# EAGLE design nolleblink2013 (EAGLE 6.4)
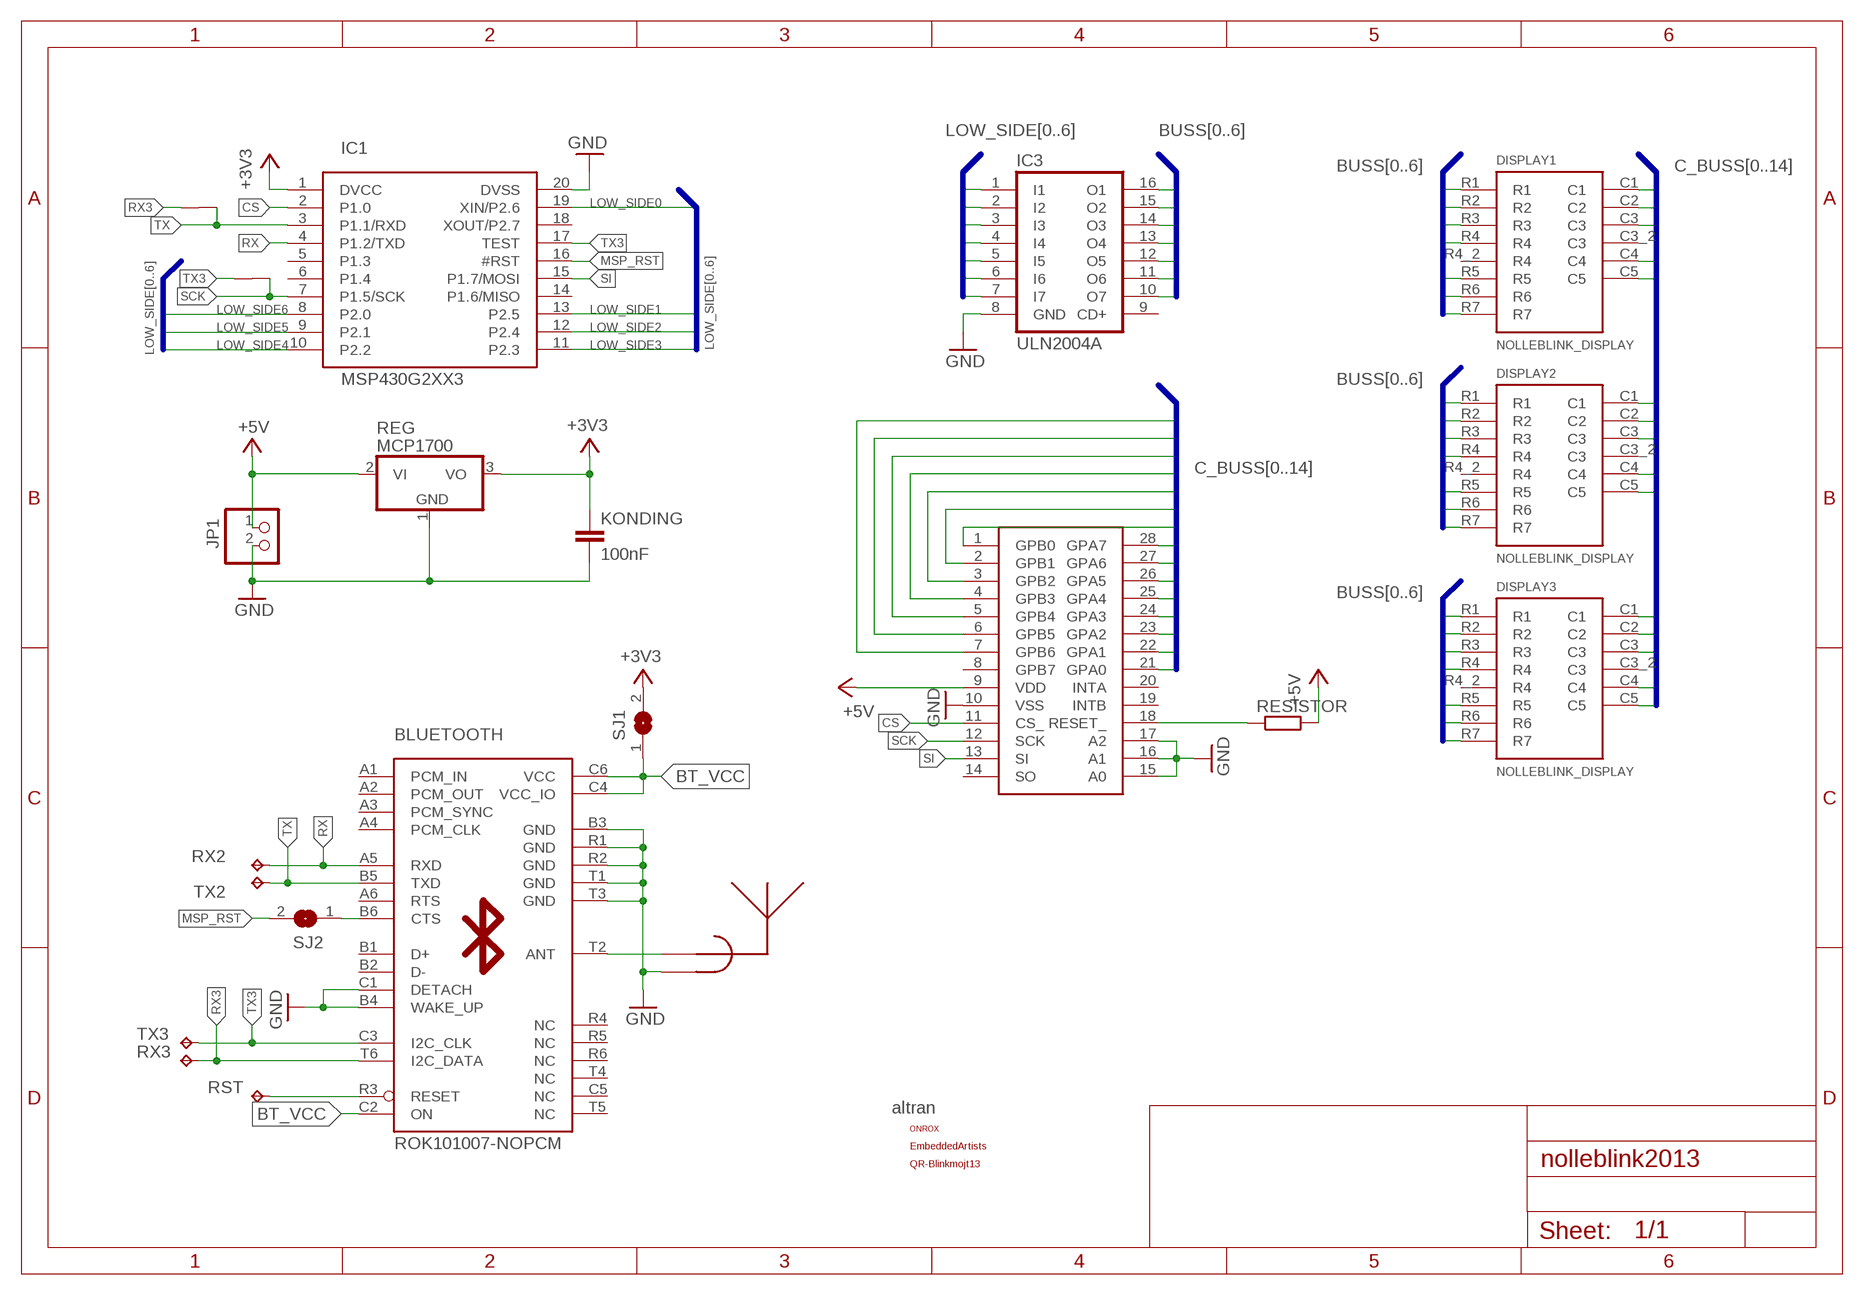
[diagram p0: schematic, sheet 1]

## Parts
BLUETOOTH  ROK101007-NOPCM  [ROK101007_NOPCM]
DISPLAY1  NOLLEBLINK_DISPLAY  [KINGBRIGHT_TA12-11EWA]
DISPLAY2  NOLLEBLINK_DISPLAY  [KINGBRIGHT_TA12-11EWA]
DISPLAY3  NOLLEBLINK_DISPLAY  [KINGBRIGHT_TA12-11EWA]
IC1  MSP430G2XX3  [N20]
IC2  MCPS23S17  [MCP23S17]
IC3  ULN2004A  ULN2004AN  [DIL16]
JP1  PINHD-1X2  [1X02]
KONDING  100nF  C-EU050-030X075  [C050-030X075]
REG  MCP1700  MCP_REGULATOR  [TO92_REGULATOR]
RESISTOR  R-EU_0207/10  [0207/10]
RST  TPTP12SQ  [TP12SQ]
RX2  TPTP20SQ  [TP20SQ]
RX3  TPTP12SQ  [TP12SQ]
SJ1  SJ  [SJ]
SJ2  SJ  [SJ]
TX2  TPTP20SQ  [TP20SQ]
TX3  TPTP12SQ  [TP12SQ]
U$1  ALTRAN  [ALTRAN]
U$2  ONROX  [ONROX]
U$3  INV_F_24  [INV_F_ANTENNA]
U$4  EMBEDDEDARTISTS  [EMBEDDEDARTISTS]
U$5  JUNCTION  [JUNCTION]
U$6  JUNCTION  [JUNCTION]
U$7  BLINKMOJT13  [BLINKMOJT13]

## Nets
+3V3: IC1.1(DVCC) KONDING.1 REG.3(VO) SJ1.2
+5V: IC2.9(VDD) JP1.1 REG.2(VI) RESISTOR.2
BT_VCC: BLUETOOTH.C2(ON) BLUETOOTH.C4(VCC_IO) BLUETOOTH.C6(VCC) SJ1.1
BUSS0: DISPLAY1.R1 DISPLAY2.R1 DISPLAY3.R1 IC3.16(O1)
BUSS1: DISPLAY1.R2 DISPLAY2.R2 DISPLAY3.R2 IC3.15(O2)
BUSS2: DISPLAY1.R3 DISPLAY2.R3 DISPLAY3.R3 IC3.14(O3)
BUSS3: DISPLAY1.R4 DISPLAY2.R4 DISPLAY3.R4 IC3.13(O4)
BUSS4: DISPLAY1.R5 DISPLAY2.R5 DISPLAY3.R5 IC3.12(O5)
BUSS5: DISPLAY1.R6 DISPLAY2.R6 DISPLAY3.R6 IC3.11(O6)
BUSS6: DISPLAY1.R7 DISPLAY2.R7 DISPLAY3.R7 IC3.10(O7)
C_BUSS0: DISPLAY1.C1 IC2.21(GPA0)
C_BUSS1: DISPLAY1.C2 IC2.22(GPA1)
C_BUSS2: DISPLAY1.C3 IC2.23(GPA2)
C_BUSS3: DISPLAY1.C4 IC2.24(GPA3)
C_BUSS4: DISPLAY1.C5 IC2.25(GPA4)
C_BUSS5: DISPLAY2.C1 IC2.26(GPA5)
C_BUSS6: DISPLAY2.C2 IC2.27(GPA6)
C_BUSS7: DISPLAY2.C3 IC2.28(GPA7)
C_BUSS8: DISPLAY2.C4 IC2.1(GPB0)
C_BUSS9: DISPLAY2.C5 IC2.2(GPB1)
C_BUSS10: DISPLAY3.C1 IC2.3(GPB2)
C_BUSS11: DISPLAY3.C2 IC2.4(GPB3)
C_BUSS12: DISPLAY3.C3 IC2.5(GPB4)
C_BUSS13: DISPLAY3.C4 IC2.6(GPB5)
C_BUSS14: DISPLAY3.C5 IC2.7(GPB6)
CS: IC1.2(P1.0) IC2.11(CS_)
GND: BLUETOOTH.B3(GND) BLUETOOTH.B4(WAKE_UP) BLUETOOTH.C1(DETACH) BLUETOOTH.R1(GND) BLUETOOTH.R2(GND) BLUETOOTH.T1(GND) BLUETOOTH.T3(GND) IC1.20(DVSS) IC2.10(VSS) IC2.15(A0) IC2.16(A1) IC2.17(A2) IC3.8(GND) JP1.2 KONDING.2 REG.1(GND) U$3.GND
LOW_SIDE0: IC1.19(XIN/P2.6) IC3.7(I7)
LOW_SIDE1: IC1.13(P2.5) IC3.6(I6)
LOW_SIDE2: IC1.12(P2.4) IC3.5(I5)
LOW_SIDE3: IC1.11(P2.3) IC3.4(I4)
LOW_SIDE4: IC1.10(P2.2) IC3.3(I3)
LOW_SIDE5: IC1.9(P2.1) IC3.2(I2)
LOW_SIDE6: IC1.8(P2.0) IC3.1(I1)
MSP_RST: IC1.16(#RST) SJ2.2
N$1: BLUETOOTH.B6(CTS) SJ2.1
N$4: IC2.18(RESET_) RESISTOR.1
N$5: BLUETOOTH.T2(ANT) U$3.FEED(RF)
N$8: BLUETOOTH.R3(RESET) RST.TP
RX: BLUETOOTH.A5(RXD) IC1.4(P1.2/TXD) RX2.TP
RX3: BLUETOOTH.T6(I2C_DATA) RX3.TP U$6.P$2
SCK: IC1.7(P1.5/SCK) IC2.12(SCK) U$5.P$1
SI: IC1.15(P1.7/MOSI) IC2.13(SI)
TX: BLUETOOTH.B5(TXD) IC1.3(P1.1/RXD) TX2.TP U$6.P$1
TX3: BLUETOOTH.C3(I2C_CLK) IC1.17(TEST) TX3.TP U$5.P$2
Unconnected: BLUETOOTH.A1(PCM_IN) BLUETOOTH.A2(PCM_OUT) BLUETOOTH.A3(PCM_SYNC) BLUETOOTH.A4(PCM_CLK) BLUETOOTH.A6(RTS) BLUETOOTH.B1(D+) BLUETOOTH.B2(D-) BLUETOOTH.C5(NC) BLUETOOTH.R4(NC) BLUETOOTH.R5(NC) BLUETOOTH.R6(NC) BLUETOOTH.T4(NC) BLUETOOTH.T5(NC) DISPLAY1.C3_2(C3) DISPLAY1.R4_2(R4) DISPLAY2.C3_2(C3) DISPLAY2.R4_2(R4) DISPLAY3.C3_2(C3) DISPLAY3.R4_2(R4) IC1.5(P1.3) IC1.6(P1.4) IC1.14(P1.6/MISO) IC1.18(XOUT/P2.7) IC2.8(GPB7) IC2.14(SO) IC2.19(INTB) IC2.20(INTA) IC3.9(CD+)

## Buses
BUSS[0..6]
LOW_SIDE[0..6]
C_BUSS[0..14]

## Library data of the parts
BLUETOOTH = etf-ericsson-bluetooth:ROK101007: Ericsson ROK 101 007 Bluetooth Module F*ck yeah! 110215 kongo@etf.nu
DISPLAY1-DISPLAY3 = stefan:NOLLEBLINK_DISPLAY: Nolleblinkmojt Display 2009 www.etf.nu
IC1 = msp430g2xx3:MSP430G2XX3
IC2 = microchip2:MCPS23S17
IC3 = uln-udn:ULN2004A: DRIVER ARRAY
JP1 = pinhead:PINHD-1X2: PIN HEADER
KONDING = rcl:C-EU: CAPACITOR, European symbol
REG = ag:MCP_REGULATOR
RESISTOR = rcl:R-EU_: RESISTOR, European symbol
RST RX2 RX3 TX2 TX3 = testpad:TP: Test pad
SJ1 SJ2 = jumper:SJ: SMD solder JUMPER
U$1 = mine:ALTRAN
U$2 = etf-logos:ONROX
U$3 = inverted_f:INV_F_24
U$4 = etf-logos:EMBEDDEDARTISTS
U$5 U$6 = junction:JUNCTION
U$7 = etf-logos:BLINKMOJT13

## Board
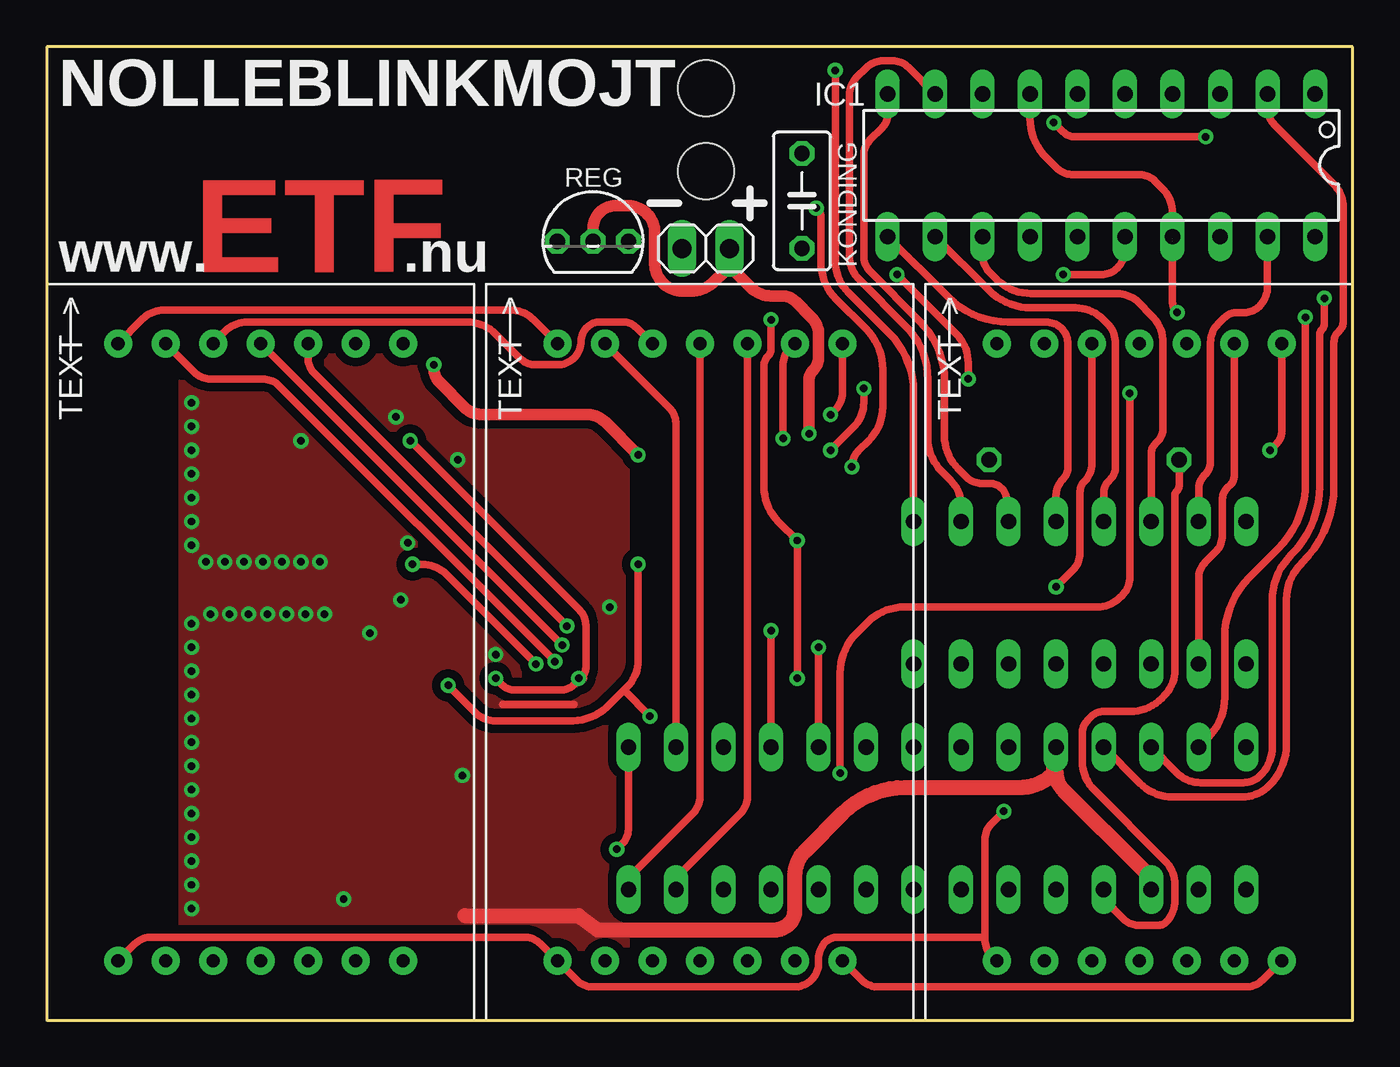
[diagram p1: board, top side]
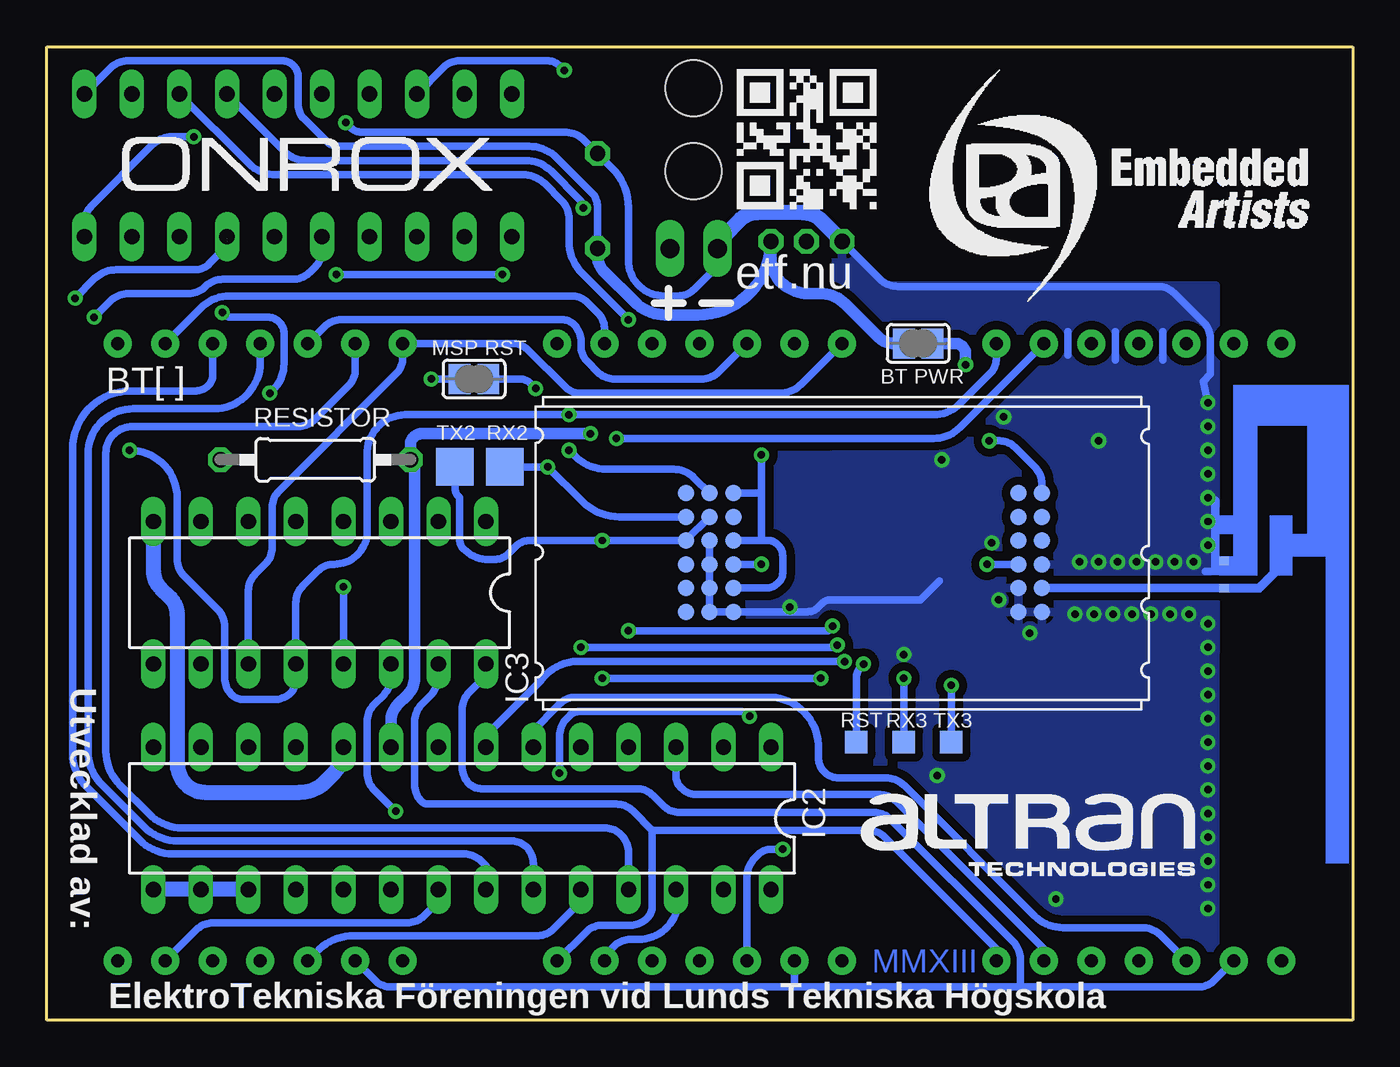
[diagram p2: board, bottom side, seen from below]

Size 69.84 x 52.06 mm. Coordinates in mm from the lower left corner, seen from the top.
Outline: 0,0 69.84,0 69.84,52.06 0,52.06 0,0
Copper layers (1*16): Top 0.035mm / dielectric 1.5mm / Bottom 0.035mm
Design rules "default *": minimum track width 10mil, minimum drill 24mil, track to track 8mil, track to pad 8mil, pad to pad 8mil, via to via 8mil, smd to smd 8mil, copper to edge 40mil, drill to drill 8mil, minimum pad ring 10mil, minimum via ring 8mil, stop-mask expansion 4mil, vias tented up to drill 16mil, thermal gap 10mil
Holes 3 mm at 35.24,49.85 35.24,45.4

### Footprints (pad centres in the part's own frame; a part is rotated, then mirrored left to right if it is on the bottom)
ROK101007_NOPCM = smd 0.889 x 0.889: A1 24.76,-3.12; A2 24.76,-4.39; A3 24.76,-5.66; A4 24.76,-6.93; A5 24.76,-8.2; A6 24.76,-9.47; B1 23.5,-3.12; B2 23.5,-4.39; B3 23.5,-5.66; B4 23.5,-6.93; B5 23.5,-8.2; B6 23.5,-9.47; C1 22.22,-3.12; C2 22.22,-4.39; C3 22.22,-5.66; C4 22.22,-6.93; C5 22.22,-8.2; C6 22.22,-9.47; R1 6.98,-3.12; R2 6.98,-4.39; R3 6.98,-5.66; R4 6.98,-6.93; R5 6.98,-8.2; R6 6.98,-9.47; T1 5.72,-3.12; T2 5.72,-4.39; T3 5.72,-5.66; T4 5.72,-6.93; T5 5.72,-8.2; T6 5.72,-9.47
KINGBRIGHT_TA12-11EWA = drill 0.7 pad 1.5: C1 5.08,-16.51; C2 2.54,16.51; C3 0,16.51; C3_2 0,-16.51; C4 -2.54,-16.51; C5 -5.08,16.51; R1 -5.08,-16.51; R2 7.62,-16.51; R3 -7.62,-16.51; R4 -2.54,16.51; R4_2 2.54,-16.51; R5 7.62,16.51; R6 -7.62,16.51; R7 5.08,16.51
N20 = drill 0.813 long: 1 -11.435,-3.81; 2 -8.895,-3.81; 3 -6.355,-3.81; 4 -3.815,-3.81; 5 -1.275,-3.81; 6 1.265,-3.81; 7 3.805,-3.81; 8 6.345,-3.81; 9 8.885,-3.81; 10 11.425,-3.81; 11 11.425,3.81; 12 8.885,3.81; 13 6.345,3.81; 14 3.805,3.81; 15 1.265,3.81; 16 -1.275,3.81; 17 -3.815,3.81; 18 -6.355,3.81; 19 -8.895,3.81; 20 -11.435,3.81
MCP23S17 = drill 0.813 long: 1 -12.7,-3.81; 2 -10.16,-3.81; 3 -7.62,-3.81; 4 -5.08,-3.81; 5 -2.54,-3.81; 6 0,-3.81; 7 2.54,-3.81; 8 5.08,-3.81; 9 7.62,-3.81; 10 10.16,-3.81; 11 12.7,-3.81; 12 15.24,-3.81; 13 17.78,-3.81; 14 20.32,-3.81; 15 20.32,3.81; 16 17.78,3.81; 17 15.24,3.81; 18 12.7,3.81; 19 10.16,3.81; 20 7.62,3.81; 21 5.08,3.81; 22 2.54,3.81; 23 0,3.81; 24 -2.54,3.81; 25 -5.08,3.81; 26 -7.62,3.81; 27 -10.16,3.81; 28 -12.7,3.81
DIL16 = drill 0.813 long: 1 -8.89,-3.81; 2 -6.35,-3.81; 3 -3.81,-3.81; 4 -1.27,-3.81; 5 1.27,-3.81; 6 3.81,-3.81; 7 6.35,-3.81; 8 8.89,-3.81; 9 8.89,3.81; 10 6.35,3.81; 11 3.81,3.81; 12 1.27,3.81; 13 -1.27,3.81; 14 -3.81,3.81; 15 -6.35,3.81; 16 -8.89,3.81
1X02 = drill 1.016 long: 1 -1.27,0; 2 1.27,0
C050-030X075 = drill 0.813 octagon: 1 -2.54,0; 2 2.54,0
TO92_REGULATOR = drill 0.813 octagon: 1 -1.905,0; 2 0,0; 3 1.905,0
0207/10 = drill 0.813 octagon: 1 -5.08,0; 2 5.08,0
TP12SQ = smd 1.2 x 1.2: TP 0,0
TP20SQ = smd 2 x 2: TP 0,0
SJ = smd 1.168 x 1.6: 1 -0.762,0; 2 0.762,0
INV_F_ANTENNA = smd 0.46 x 0.5: FEED 10.86,0.253; GND 9.413,0.25
JUNCTION = smd 0.152 x 0.152: P$1 0,0; P$2 0.152,0

### Placement (x,y rotation side)
BLUETOOTH  10.9,18.72 180 bottom
DISPLAY1  58.42,19.68 0 top
DISPLAY2  34.92,19.68 0 top
DISPLAY3  11.43,19.68 0 top
IC1  56.39,45.72 180 top
IC2  43.81,10.79 180 bottom
IC3  55.24,22.86 180 bottom
JP1  35.24,41.27 180 top
KONDING  40.39,43.81 90 top
REG  29.21,41.66 0 top
RESISTOR  55.47,29.97 0 bottom
RST  26.54,14.86 0 bottom
RX2  45.34,29.59 0 bottom
RX3  24,14.86 90 bottom
SJ1  23.24,36.2 180 bottom
SJ2  46.99,34.29 180 bottom
TX2  48.01,29.59 0 bottom
TX3  21.46,14.86 90 bottom
U$1  5.07,4.81 0 top
U$2  65.79,44.07 0 bottom
U$3  7.13,33.97 270 bottom
U$4  22.61,38.35 0 bottom
U$5  60.2,41.66 90 bottom
U$6  28.7,18.29 180 top
U$7  33.27,43.05 0 bottom

### Tracks (layer width: path | path; a pad name or v marks a point on that pad's centre or on a via)
+3V3
  Bottom 0.406: KONDING.1 40.39,43.49 arc-45 40.7,44.26 42.57,46.13 arc-45 44.04,46.74 54.23,46.74 arc45 54.88,47.01 56.08,48.21 arc45 56.39,48.95 56.39,50.43 arc-45 56.65,51.06 arc-45 57.24,51.31 65.47,51.31 arc-45 66.45,50.91 IC1.1
  Bottom 0.61: KONDING.1 40.39,40.89 arc-45 40.03,40.04 38.39,38.4 arc-45 36.75,37.72 35.05,37.72 arc-90 REG.3 31.11,40.75 arc-45 30.59,39.48 arc-45 29.1,38.86 28.48,38.86 arc45 27.13,38.3 25.3,36.48 arc-45 24.62,36.2 SJ1.2
+5V  (via drill 0.4)
  Top 0.406: 36.45,41.34 JP1.1 36.58,41.21 36.58,40.99
  Top 0.61: v40.77,31.37 40.77,34.27 arc-45 40.96,34.74 arc45 41.27,35.5 41.27,36.64 arc45 40.87,37.61 40.05,38.44 arc45 39.33,38.73 38.73,38.73 arc-45 37.65,39.18 36.9,39.93 arc-45 36.51,40.88 JP1.1 | REG.2 29.21,42.36 arc-90 30.41,43.56 31.07,43.56 arc-90 32.51,42.12 32.51,40.47 arc90 33.99,38.99 34.43,38.99 arc45 35.71,39.52 36.15,39.96 arc45 36.58,40.99
  Bottom 0.61: IC2.9 51.44,15.98 arc45 51.06,16.88 50.54,17.41 arc-45 50.16,18.31 50.16,29.74 RESISTOR.2 50.39,30.75 arc90 49.78,31.37 v40.77,31.37
BT_VCC  (via drill 0.4)
  Top 0.406: 20.7,34.84 v20.7,35.05
  Top 0.61: v31.62,30.23 29.84,32.01 arc45 28.93,32.38 23.28,32.38 arc-45 22.34,32.77 21,34.12 arc-45 20.7,34.84
  Bottom 0.406: 31.62,28.19 BLUETOOTH.C6 | 31.62,25.65 BLUETOOTH.C4 | 31.62,28.19 31.62,25.65 | v31.62,30.23 31.62,28.19 | BLUETOOTH.C2 31.4,23.11 arc-45 30.7,23.4 30.7,23.41 arc-45 30.48,23.93 30.48,24.81 arc-45 30.71,25.38 30.82,25.49 arc-45 31.22,25.65 31.62,25.65
  Bottom 0.61: v20.7,35.05 20.7,35.63 arc-90 21.27,36.2 SJ1.1
BUSS0
  Bottom 0.406: IC3.16 46.35,18.89 arc45 46.69,18.08 47.25,17.52 arc-45 47.62,16.62 47.62,13.54 arc-45 47.25,12.65 arc-45 46.62,12.38 38.31,12.38 arc45 37.41,12.01 36.88,11.48 arc-45 35.99,11.11 25.61,11.11 arc45 24.71,10.74 18.15,4.18 arc45 17.78,3.28 17.78,1.78 | 17.78,1.78 29.84,1.78 | 29.84,1.78 DISPLAY2.R1 | 29.84,1.78 51.42,1.78 arc45 52.31,2.15 DISPLAY1.R1 | 17.78,1.78 8.27,1.78 arc-45 7.38,2.15 DISPLAY3.R1
BUSS1
  Top 0.406: DISPLAY2.R2 43.57,2.15 arc45 44.47,1.78 64.12,1.78 arc45 65.02,2.15 DISPLAY1.R2
  Bottom 0.406: IC3.15 48.9,18.41 arc45 49.34,17.33 49.79,16.88 arc-45 50.16,15.98 50.16,12.59 arc-45 49.79,11.69 arc-45 49.47,11.56 39.39,11.56 arc45 38.49,11.19 37.47,10.16 | 37.47,10.16 37.47,6.09 arc45 37.73,5.45 arc45 38.63,5.08 40.11,5.08 arc-45 41.01,4.71 DISPLAY2.R2 | DISPLAY3.R2 19.05,3.81 25.03,9.79 arc-45 25.93,10.16 37.47,10.16
BUSS2  (via drill 0.4)
  Top 0.406: 50.16,4.45 50.16,9.63 arc-45 50.54,10.53 v51.18,11.18 | 50.16,4.45 50.16,4.34 arc45 50.54,3.44 DISPLAY1.R3 | DISPLAY3.R3 4.71,4.07 arc-45 5.61,4.45 25.51,4.45 arc-45 26.41,4.07 DISPLAY2.R3 28.33,2.15 arc45 29.23,1.78 39.99,1.78 arc45 40.88,2.15 40.9,2.17 arc45 41.27,3.07 41.27,3.28 arc-45 41.65,4.18 arc-45 42.28,4.45 50.16,4.45
  Bottom 0.406: v51.18,11.18 52.33,12.33 arc45 52.7,13.23 52.7,15.98 arc45 52.33,16.88 51.81,17.41 arc-45 51.44,18.31 IC3.14
BUSS3  (via drill 0.4)
  Top 0.406: v53.98,23.18 54.87,24.08 arc45 55.24,24.97 55.24,28.2 arc-45 55.51,28.84 arc45 55.88,29.74 DISPLAY1.R4 | DISPLAY3.R4 9.55,36.85 arc-45 10.72,37.34 22.47,37.34 arc-45 24,36.7 25.31,35.4 arc45 26.14,35.05 27.3,35.05 arc90 28.57,36.32 arc-90 29.59,37.34 30.83,37.34 arc-45 31.53,37.05 DISPLAY2.R4
  Bottom 0.406: v53.98,23.18 IC3.13 | DISPLAY1.R4 54.98,37.09 arc45 54.08,37.47 42.28,37.47 arc45 41.65,37.2 arc45 41.27,36.3 41.27,36.09 arc-45 40.9,35.19 40.38,34.66 arc-45 39.48,34.29 34.82,34.29 arc-45 33.92,34.66 DISPLAY2.R4
BUSS4  (via drill 0.4)
  Top 0.406: v65.41,30.48 65.78,30.85 arc45 66.04,31.49 DISPLAY1.R5 | v41.91,32.38 42.17,32.65 arc45 42.55,33.55 DISPLAY2.R5
  Bottom 0.406: DISPLAY3.R5 19.05,35.45 arc45 19.42,34.55 21,32.97 arc45 22.42,32.38 v41.91,32.38 50.67,32.38 arc-90 52.7,30.23 52.7,26.14 arc90 54.47,24.38 arc-45 55.36,24.01 56.14,23.23 arc-45 56.52,22.33 IC3.12 56.52,18.15 arc45 56.78,17.52 arc45 57.68,17.14 59.32,17.14 arc45 59.95,17.41 arc45 60.33,18.31 60.33,21.06 arc-45 60.7,21.96 62.49,23.76 arc45 62.87,24.66 62.87,27.94 arc-90 v65.41,30.48
BUSS5
  Top 0.406: DISPLAY3.R6 5.1,37.49 arc-45 6.27,37.97 24.8,37.97 arc-45 26.04,37.46 DISPLAY2.R6
  Bottom 0.406: IC3.11 59.05,22.97 arc45 58.68,23.87 58.16,24.39 arc-45 57.78,25.29 57.78,27.41 arc45 57.41,28.31 51.17,34.55 arc-45 50.8,35.45 DISPLAY1.R6 44.98,36.2 arc45 44.08,35.82 42.16,33.9 arc-45 41.26,33.53 30.62,33.53 arc-45 29.47,34.03 DISPLAY2.R6
BUSS6  (via drill 0.4)
  Top 0.406: IC3.10 61.59,23.6 arc-45 61.97,24.5 62.49,25.03 arc45 62.87,25.93 62.87,27.82 arc-45 63.14,28.48 63.32,28.65 arc45 63.5,29.1 DISPLAY1.R7 | v39.37,31.11 39.37,35.03 arc-45 39.74,35.93 DISPLAY2.R7
  Bottom 0.406: DISPLAY2.R7 40.01,36.94 arc-45 40.38,37.84 40.9,38.36 arc-45 41.8,38.73 60.04,38.73 arc-45 61.61,38.09 DISPLAY1.R7 | DISPLAY3.R7 21,31.7 arc45 22.42,31.11 v39.37,31.11
C_BUSS0
  Bottom 0.406: IC2.21 48.9,6.93 arc45 49.3,5.94 49.67,5.58 arc45 50.56,5.21 60.94,5.21 arc-45 61.84,4.83 DISPLAY1.C1
C_BUSS1
  Bottom 0.406: IC2.22 46.35,8.26 46.62,8.52 arc-45 47.52,8.89 63.08,8.89 arc45 64.88,9.63 67.71,12.46 arc45 68.45,14.26 68.45,30.55 arc90 65.35,33.66 61.86,33.66 arc-90 60.96,34.55 DISPLAY1.C2
C_BUSS2
  Bottom 0.406: IC2.23 43.81,8.36 arc-45 44.19,9.26 arc-45 44.98,9.59 62.83,9.59 arc45 64.62,10.33 66.88,12.59 arc45 67.63,14.39 67.63,30.29 arc90 65.21,32.7 60.9,32.7 arc-90 58.42,35.18 DISPLAY1.C3
C_BUSS3
  Bottom 0.406: IC2.24 arc45 41.72,5.9 42.74,4.88 arc45 43.64,4.51 53.62,4.51 arc-45 55.42,3.64 DISPLAY1.C4
C_BUSS4
  Bottom 0.406: IC2.25 38.73,9 arc-45 39.11,9.9 39.12,9.91 arc-45 40.02,10.29 62.58,10.29 arc45 64.37,11.03 65.93,12.59 arc45 66.67,14.39 66.67,30.33 arc90 65.25,31.75 56.41,31.75 arc-45 55.51,32.12 53.71,33.92 arc-45 53.34,34.82 DISPLAY1.C5
C_BUSS5
  Bottom 0.406: IC2.26 36.2,5.78 arc22 36.22,5.65 arc68 38.21,4.32 38.6,4.32 arc-61 39.74,3.65 DISPLAY2.C1
C_BUSS6
  Top 0.406: IC2.27 33.66,7.62 37.09,11.06 arc45 37.47,11.96 DISPLAY2.C2
C_BUSS7
  Top 0.406: IC2.28 31.11,7.62 34.55,11.06 arc45 34.92,11.96 DISPLAY2.C3
C_BUSS8  (via drill 0.4)
  Top 0.406: IC2.1 31.11,10.3 arc-45 30.74,9.41 v30.48,9.14
  Bottom 0.406: v30.48,9.14 31.09,9.14 arc-45 31.78,8.86 31.98,8.66 arc-45 32.38,7.69 DISPLAY2.C4
C_BUSS9
  Top 0.406: IC2.2 33.66,31.86 arc45 33.28,32.76 DISPLAY2.C5
C_BUSS10
  Bottom 0.406: IC2.3 36.2,13.07 arc-45 35.93,12.44 arc-45 35.03,12.06 25.29,12.06 arc45 24.39,11.69 16.51,3.81 DISPLAY3.C1
C_BUSS11  (via drill 0.4)
  Top 0.406: v38.73,20.83 IC2.4 | DISPLAY3.C2 13.97,35.45 arc45 14.34,34.55 v27.81,21.08
  Bottom 0.406: v27.81,21.08 28.07,20.83 v38.73,20.83
C_BUSS12  (via drill 0.4)
  Top 0.406: v41.27,19.94 IC2.5 | v27.56,20.07 DISPLAY3.C3
  Bottom 0.406: v27.56,20.07 27.69,19.94 v41.27,19.94
C_BUSS13
  Bottom 0.406: IC2.6 43.81,15.49 42.48,16.83 arc45 41.66,17.27 31.11,17.27 arc90 28.57,14.49 28.57,14.05 arc-90 27.48,12.95 24.98,12.95 arc45 23.96,12.53 17.02,5.59 arc-45 15.49,4.95 11.31,4.95 arc45 10.21,4.5 DISPLAY3.C4
C_BUSS14  (via drill 0.4)
  Top 0.406: DISPLAY3.C5 7.88,34.66 arc45 8.78,34.29 11.54,34.29 arc-45 12.44,33.92 v27.18,19.18
  Bottom 0.406: IC2.7 46.35,15.24 43.44,18.15 arc45 41.69,19.18 v27.18,19.18
CS
  Top 0.406: IC2.11 58.45,12.67 arc45 60.22,11.94 63.9,11.94 arc45 65.38,12.55 arc45 66.29,14.75 66.29,22.51 arc-45 67.08,24.41 67.12,24.45 arc45 68.83,28.59 68.83,36.27 arc-45 69.05,36.79 69.1,36.85 arc45 69.34,37.42 69.34,43.47 arc45 68.83,44.71 65.65,47.89 arc-45 65.28,48.79 IC1.2
GND  (via drill 0.4)
  Top 0.406: IC2.10 53.98,13.23 53.87,13.23 53.85,13.21 | v53.85,48.01 54.35,47.51 arc45 54.98,47.24 v61.98,47.24 | 24.38,16.89 28.19,16.89
  Top 0.813: IC2.17 59.05,7.04 arc45 58.65,8.03 54.35,12.33 arc-45 53.98,13.23 | 22.35,5.59 28.45,5.59 29.46,4.83 38.88,4.83 arc45 39.71,5.17 arc45 40.01,5.87 40.01,7.72 arc-45 40.56,9.07 42.57,11.07 arc-45 45.88,12.45 52.01,12.45 arc45 53.85,13.21 53.85,14.73
  Bottom 0.406: 33.66,41.91 33.66,41.59 | JP1.2 33.97,40.32 35.19,39.11 arc45 36.09,38.73 36.83,38.73 arc90 38.73,40.64 38.73,43.48 arc-45 39.6,45.57 KONDING.2 41.08,47.04 arc-45 42.17,47.5 53.04,47.5 arc45 53.55,47.71 v53.85,48.01 | 6.86,24 7.87,24 | 22.1,23.5 23.11,22.48 27.96,22.48 arc-45 28.36,22.31 28.6,22.08 arc45 29.16,21.84 BLUETOOTH.C1 34.4,21.84 BLUETOOTH.B3 BLUETOOTH.B4 | REG.1 25.29,39.64 arc-45 24.32,39.24 10.43,39.24 arc45 9.54,38.88 7.96,37.3 arc45 7.62,36.47 7.62,34.54 8,34.16 v7.75,33.02 | v61.98,47.24 63.14,47.24 arc-45 64.19,46.81 67.45,43.55 arc-45 67.82,42.66 IC1.20 | 10.16,35.31 10.16,36.83 | 12.7,35.31 12.7,36.83 | 15.24,35.56 15.24,36.83
  Bottom 0.457: 7.36,24.56 7.36,27.8 | U$3.GND 7.36,24.56 | 7.36,24.56 7.36,24.03
  Bottom 0.813: IC3.8 64.14,24.02 arc-45 63.76,23.12 63.24,22.6 arc45 62.87,21.7 62.87,13.78 arc-45 62.37,12.59 arc-45 61.42,12.19 56.29,12.19 arc-45 54.94,12.75 54.54,13.15 arc-45 53.98,14.51 IC2.10 | IC2.15 IC2.16 IC2.17 | 33.66,41.91 32.76,42.81 arc45 31.86,43.18 29.38,43.18 arc45 28.44,42.79 REG.1 | 33.66,41.59 JP1.2
  other vias: 8.51,24.51 8.76,21.72 17.27,20.7 18.92,22.48 7.75,5.97 19.3,25.53 15.88,6.48 13.59,30.99 22.23,13.08 7.75,7.24 7.75,8.51 7.75,9.78 7.75,11.05 7.75,12.32 7.75,13.59 7.75,14.86 7.75,16.13 7.75,17.4 7.75,18.67 7.75,19.94 7.75,21.21 7.75,31.75 7.75,30.48 7.75,29.21 7.75,27.94 7.75,26.67 7.75,25.4 9.53,24.51 10.54,24.51 11.56,24.51 9.78,21.72 10.79,21.72 11.81,21.72 12.83,21.72 13.84,21.72 14.86,21.72 12.57,24.51 13.59,24.51 14.61,24.51 18.67,32.26 21.97,29.97 30.1,22.1 24,19.56
  pour Bottom (isolate 0.432): 69.81,0 7.36,0 7.32,39.27 25.05,39.27 25.4,39.62 27.63,41.86 27.67,0.07
  pour Top (isolate 0.457): 7.25,-0.02 30.97,-0.02 30.99,39.32 7.25,39.32
  pour Bottom (isolate 0.457): 21.84,22.48 21.84,30.48 31.75,30.23 34.67,21.46 22.86,21.46
LOW_SIDE0
  Top 0.406: IC3.7 61.59,28.38 arc-45 61.91,29.14 arc45 62.23,29.92 62.23,36.24 arc-45 62.65,37.25 62.95,37.55 arc-45 63.67,37.85 64.05,37.85 arc45 64.84,38.17 arc45 65.28,39.22 IC1.19
LOW_SIDE1
  Top 0.406: IC1.13 50.04,40.91 arc45 50.41,40.01 50.81,39.62 arc45 52.63,38.86 57.23,38.86 arc-45 58.4,38.38 59.08,37.69 arc-45 59.69,36.22 59.69,31.65 arc-45 59.4,30.95 59.29,30.84 arc45 59.05,30.27 IC3.6
LOW_SIDE2
  Top 0.406: IC1.12 50.38,39.04 arc45 52.64,38.1 55,38.1 arc-45 56.5,37.48 56.7,37.28 arc-45 57.15,36.19 57.15,29.56 arc-45 56.9,28.96 56.78,28.84 arc45 56.52,28.2 IC3.5
LOW_SIDE3
  Top 0.406: IC1.11 48.22,38.66 arc45 51.4,37.34 53.44,37.34 arc-90 54.61,36.17 54.61,29.56 arc-45 54.36,28.96 54.33,28.93 arc45 53.98,28.08 IC3.4
LOW_SIDE4
  Top 0.406: IC1.10 44.96,48.44 arc-45 44.66,47.71 44.03,47.08 arc45 43.69,46.25 43.69,40.88 arc45 44.04,40.03 46.68,37.4 arc-45 48.01,34.19 48.01,31.24 arc45 48.72,29.51 49.19,29.05 arc45 50.02,28.7 50.43,28.7 arc-45 51.06,28.44 51.12,28.38 arc-45 51.31,27.93 51.31,26.8 IC3.3
LOW_SIDE5
  Top 0.406: IC1.9 46.08,50.96 arc45 45.23,51.31 44.72,51.31 arc45 43.83,50.94 43.3,50.42 arc45 42.93,49.5 42.93,40.88 arc45 43.45,39.61 45.93,37.13 arc-45 47.12,34.26 47.12,31.12 arc45 47.84,29.38 48.33,28.89 arc-45 48.9,27.52 IC3.2
LOW_SIDE6  (via drill 0.4)
  Top 0.406: v42.16,50.8 42.16,40.59 arc45 42.85,38.94 45.06,36.73 arc-45 46.35,33.6 IC3.1
  Bottom 0.406: IC1.8 48.61,50.96 arc45 47.78,51.31 43.08,51.31 arc45 42.38,51.02 v42.16,50.8
MSP_RST  (via drill 0.4)
  Top 0.406: v49.28,34.29 49.28,35.14 arc45 48.62,36.73 v45.47,39.88 | v54.36,39.88 56.4,39.88 arc45 57.25,40.23 arc45 57.66,41.22 IC1.16
  Bottom 0.406: SJ2.2 v49.28,34.29 | v45.47,39.88 v54.36,39.88
N$1  (via drill 0.4)
  Top 0.406: v41.91,30.48 43.14,31.71 arc45 43.69,33.03 v43.69,33.78
  Bottom 0.406: BLUETOOTH.B6 35.22,29.01 arc-45 36.32,29.46 39.91,29.46 arc45 41.59,30.16 v41.91,30.48 | v43.69,33.78 43.96,34.05 arc-45 44.53,34.29 SJ2.1
N$2
  Bottom 0.406: 46.48,34.29 47.5,34.29
N$3
  Bottom 0.406: 22.73,36.2 23.62,36.2
N$4
  Top 0.406: RESISTOR.1 60.55,28.61 arc-45 60.42,28.29 arc45 60.33,28.06 60.33,18.72 arc-45 59.76,17.36 59.62,17.21 arc-45 57.92,16.51 56.51,16.51 arc45 55.87,16.24 55.68,16.05 arc45 55.37,15.31 55.37,13.85 arc45 56.01,12.32 59.8,8.53 arc-45 60.33,7.26 60.33,6.38 arc-45 59.85,5.24 arc-45 59.46,5.08 58.37,5.08 arc-45 57.59,5.4 56.52,6.48 IC2.18
N$5
  Bottom 0.457: BLUETOOTH.T2 U$3.FEED
N$8  (via drill 0.4)
  Top 0.406: v19.56,24.38 20.08,24.38 arc-45 21.35,23.86 v26.16,19.05
  Bottom 0.406: BLUETOOTH.R3 v19.56,24.38 | RST.TP 26.54,18.27 arc45 26.26,18.95 v26.16,19.05
RX  (via drill 0.4)
  Top 0.406: v41.15,43.43 41.24,43.35 arc-45 41.4,42.95 41.4,40.49 arc45 42.2,38.58 43.8,36.97 arc-45 44.7,34.79 44.7,32.81 arc-45 43.95,31 43.41,30.46 arc45 v43.05,29.59
  Bottom 0.406: BLUETOOTH.A5 39.2,26.92 arc45 41.22,27.76 v43.05,29.59 RX2.TP | IC1.4 57.15,46.48 arc-45 55.93,45.97 44.22,45.97 arc45 42.88,45.42 41.33,43.87 arc45 v41.15,43.43
RX3  (via drill 0.4)
  Top 0.406: v19.43,30.99 28.49,21.93 arc-45 28.83,21.11 28.83,18.9 arc-45 28.59,18.33 U$6.P$2 28.25,17.99 arc-45 27.44,17.65 25.01,17.65 arc-45 24.38,17.92 v24,18.29
  Bottom 0.406: RX3.TP v24,18.29 | v19.43,30.99 18.9,30.99 arc45 18.07,30.64 16.94,29.52 arc45 16.64,28.78 16.64,28.2 BLUETOOTH.T6
SCK  (via drill 0.4)  (1 unrouted)
  Top 0.406: IC2.12 60.43,13.23 arc45 61.71,12.7 63.98,12.7 arc45 64.89,13.08 arc45 65.53,14.62 65.53,22.43 arc-45 66.56,24.9 arc45 68.07,28.56 68.07,36.64 arc-45 68.21,36.96 arc45 68.33,37.25 v68.33,38.61 | IC1.7 52.58,48.25 arc45 53.48,46.09 53.95,45.61 arc45 54.92,45.21 58.46,45.21 arc-45 59.26,44.88 59.66,44.48 arc-45 60.2,43.18 U$5.P$1
  Bottom 0.406: v68.33,38.61 67.29,39.65 arc45 66.12,40.13 61.92,40.13 arc-45 61.15,40.45 60.35,41.25 arc-45 60.2,41.61 U$5.P$1
SI  (via drill 0.4)
  Top 0.406: IC2.13 62.11,15.12 arc45 62.99,17.25 62.99,20.48 arc-45 64.31,23.67 65.84,25.2 arc45 67.31,28.75 v67.31,37.59
  Bottom 0.406: v67.31,37.59 66.46,38.45 arc45 65.45,38.86 62.28,38.86 arc-45 61.33,39.26 arc45 60.44,39.62 56.7,39.62 arc-45 55.73,40.03 55.49,40.26 arc-45 55.12,41.16 IC1.15
TX  (via drill 0.4)
  Top 0.406: v40.13,18.29 v40.13,25.65 39.13,26.66 arc-45 38.35,28.53 38.35,34.99 arc-45 38.58,35.53 arc45 38.73,35.91 v38.73,37.47 | v28.45,18.29 U$6.P$1
  Bottom 0.406: BLUETOOTH.B5 35.67,25.65 v40.13,25.65 44.03,25.65 arc-45 44.75,25.35 45.15,24.95 arc45 45.91,24.64 46.21,24.64 arc45 47.54,25.19 arc45 47.75,25.7 47.75,27.84 arc-45 47.82,28.01 arc45 48.01,28.46 TX2.TP | v28.45,18.29 v40.13,18.29 | IC1.3 59.01,45.8 arc-45 57.59,45.21 44.37,45.21 arc45 43.2,44.73 42.31,43.84 arc45 41.91,42.87 41.91,41.66 arc-45 41.19,39.92 v38.73,37.47
TX3  (via drill 0.4)  (1 unrouted)
  Top 0.406: v21.46,17.91 22.91,16.46 arc45 24.01,16 28.14,16 arc45 30.11,16.91 30.86,17.65 | 30.86,17.65 31.05,17.84 arc45 31.62,19.23 v31.62,24.38 | U$5.P$2 60.2,38.46 arc45 v60.45,37.85 | v57.91,33.53 57.91,23.7 arc-45 57.5,22.7 57.4,22.6 arc-45 56.19,22.1 45.86,22.1 arc45 43.89,21.28 43.29,20.69 arc45 42.42,18.57 v42.42,13.21 | v32.26,16.26 30.86,17.65
  Bottom 0.406: BLUETOOTH.C3 v31.62,24.38 | TX3.TP v21.46,17.91 | IC1.17 U$5.P$2 IC1.17 | v60.45,37.85 60.36,37.75 arc-45 59.98,37.59 58.01,37.59 arc45 57.41,37.34 arc45 57.15,36.72 57.15,35.12 arc45 57.74,33.7 v57.91,33.53 | v42.42,13.21 42.42,15.18 arc45 42.02,16.15 41.87,16.3 arc45 41.36,16.51 32.75,16.51 arc45 32.35,16.34 v32.26,16.26

### Text on the board
Top: ETF
Bottom: MMXIII
tPlace: www. | .nu
bPlace: etf.nu
tNames: NOLLEBLINKMOJT
bNames: MSP RST | BT PWR | BT[ ] | Utvecklad av: | ElektroTekniska Föreningen vid Lunds Tekniska Högskola
tStop: ETF
Document: FEL. TVÄRTOM ---> | --> | Halv millimeter för mycket?